# Altium schematic sheet [6]-Interface_CAN.SchDoc
size A4
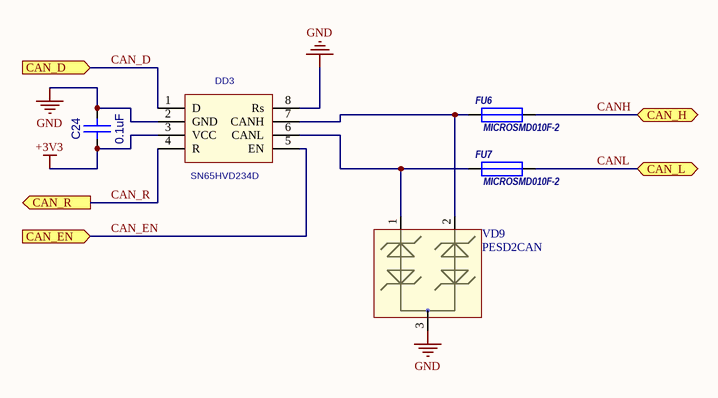
[diagram p0: [6]-Interface_CAN.SchDoc]

## Parts
C24  0.1uF  [CC0603]
DD3  SN65HVD234D  [SO-8]
FU6  MICROSMD010F-2  [RC1210]
FU7  MICROSMD010F-2  [RC1210]
VD9  PESD2CAN  [SOT-23(123)]

## Ports
CAN_D (in), CAN_EN (in), CAN_H (bidir), CAN_L (bidir), CAN_R (out)

## Nets
+3V3: C24.1(A) DD3.3(VCC)
GND: C24.2(B) DD3.2(GND) DD3.8(Rs) VD9.3
CAN_D: DD3.1(D) ; port CAN_D
CAN_EN: DD3.5(EN) ; port CAN_EN
CAN_R: DD3.4(R) ; port CAN_R
CANH: FU6.2 ; port CAN_H
CANL: FU7.2 ; port CAN_L
NetDD3_6: DD3.6(CANL) FU7.1 VD9.1
NetDD3_7: DD3.7(CANH) FU6.1 VD9.2

## Library data of the parts
C24 = CC0603: Value: 0.1uF
DD3 = SN65HVD234D: CAN Transceiver; Value: *
FU6 FU7 = MICROSMD: Value: MICROSMD010F-2
VD9 = PESD2CAN: TVS for CAN